# EAGLE schematic lt3652-pre-v05 (EAGLE 5.10)
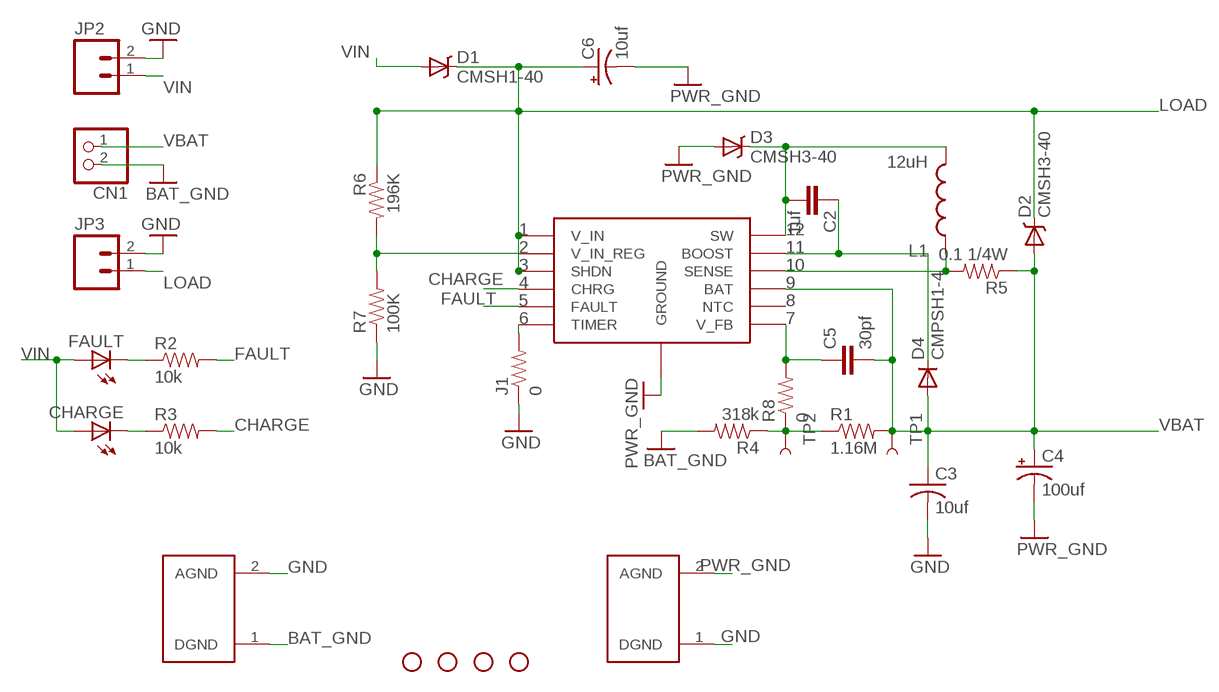
[diagram p0: schematic, sheet 1]

## Parts
C2  1uf  CAP0805  [0805]
C3  10uf  C-USC1210  [C1210]
C4  100uf  CAP_POL7343  [EIA7343]
C5  30pf  CAP0805  [0805]
C6  10uf  CAP_POLE  [PANASONIC_E]
CHARGE  LED0603  [LED-0603]
CN1  JST_2PIN-SMT-RA  [JST-PH-2-SMT-RA]
D1  CMSH1-40  CMSH3-40  [CMSH3-40]
D2  CMSH3-40  [CMSH3-40]
D3  CMSH3-40  [CMSH3-40]
D4  CMPSH1-4  DIODESMA  [SMA-DIODE]
FAULT  LED0603  [LED-0603]
J1  0  RESISTOR  [0805]
JP1  STAND-OFF  [STAND-OFF]
JP2  M023.5MM  [SCREWTERMINAL-3.5MM-2]
JP3  M023.5MM  [SCREWTERMINAL-3.5MM-2]
JP4  STAND-OFF  [STAND-OFF]
JP5  STAND-OFF  [STAND-OFF]
JP6  STAND-OFF  [STAND-OFF]
L1  12uH  PANASONIC_ELLCTV  [PANASONIC_ELLCTV]
R1  1.16M  RESISTOR0603-RES  [0603-RES]
R2  10k  RESISTOR0603-RES  [0603-RES]
R3  10k  RESISTOR0603-RES  [0603-RES]
R4  318k  RESISTOR0603-RES  [0603-RES]
R5  0.1 1/4W  RESISTOR1206  [1206]
R6  196K  RESISTOR0603-RES  [0603-RES]
R7  100K  RESISTOR0603-RES  [0603-RES]
R8  0  RESISTOR0603-RES  [0603-RES]
TP1  TEST-POINT3X5  [PAD.03X.05]
TP2  TEST-POINT3X5  [PAD.03X.05]
U$1  LTC3652_MSOP  [MSOP12]
U$2  AGND_GND  [GND_CONNECT]
U$3  AGND_GND  [GND_CONNECT]

## Nets
BAT_GND: CN1.2 R4.2 U$2.1(DGND)
CHARGE: R3.2 U$1.4(CHRG)
FAULT: R2.2 U$1.5(FAULT)
GND: J1.1 JP2.2 JP3.2 R7.1 U$2.2(AGND) U$3.1(DGND)
LOAD: C6.+ D1.2(C) D2.2(C) JP3.1 R6.1 U$1.1(V_IN) U$1.3(SHDN)
N$1: C5.1 R8.2 U$1.7(V_FB)
N$2: R1.1 R4.1 R8.1 TP2.P$1
N$3: C2.1 D4.C U$1.11(BOOST)
N$4: CHARGE.C R3.1
N$5: FAULT.C R2.1
N$6: L1.1 R5.2 U$1.10(SENSE)
N$13: C2.2 D3.2(C) L1.2 U$1.12(SW)
N$17: J1.2 U$1.6(TIMER)
N$18: R6.2 R7.2 U$1.2(V_IN_REG)
PWR_GND: C3.2 C4.C(-) C6.- D3.1(A) U$1.GND(GROUND) U$3.2(AGND) ; supply symbol labelled GND
VBAT: C3.1 C4.A(+) C5.2 CN1.1 D2.1(A) D4.A R1.2 R5.1 TP1.P$1 U$1.9(BAT)
VIN: CHARGE.A D1.1(A) FAULT.A JP2.1
Unconnected: U$1.8(NTC)

## Library data of the parts
C2 C5 = SparkFun:CAP: Capacitor Standard 0603 ceramic capacitor, and 0.1" leaded capacitor.
C3 = adafruit:C-US: CAPACITOR, American symbol
C4 C6 = SparkFun:CAP_POL: Capacitor Polarized These are standard SMD and PTH capacitors. Normally 10uF, 47uF, and 100uF in electrolytic and tantalum varieties. Always verify the external diameter of the through hole cap, it varies with capacity, voltage, and manufacturer. The EIA devices should be standard.
CHARGE FAULT = SparkFun:LED: LEDs Standard schematic elements and footprints for 5mm, 3mm, 1206, and 0603 sized LEDs. 5mm - Spark Fun Electronics SKU : COM-00529 (and others)
CN1 = adafruit:JST_2PIN: JST 2-Pin Connectors of various flavors SMT-RA (S2B-PH-SM4) 4UConnector #17311 SMT (B2B-PH-SM4) THM-RA (S2B-PH) THM (B2B-PH)
D1-D3 = ssozonoff:CMSH3-40
D4 = SparkFun:DIODE: Diode These are standard reverse protection diodes and small signal diodes. SMA package can handle up to about 1A. SOD-323 can handle about 200mA. What the SOD-323 package when ordering, there are some mfgs out there that are 5-pin packages.
J1 R1-R8 = SparkFun:RESISTOR: Resistor Basic schematic elements and footprints for 0603, 1206, and PTH 1/10th watt (small) resistors.
JP1 JP4-JP6 = SparkFun:STAND-OFF: Stand Off This is the mechanical footprint for a #4 phillips button head screw. Use the keepout ring to avoid running the screw head into surrounding components. SKU : PRT-00447
JP2 JP3 = SparkFun:M02: Header 2 Standard 2-pin 0.1" header. Use with straight break away headers (SKU : PRT-00116), right angle break away headers (PRT-00553), swiss pins (PRT-00743), machine pins (PRT-00117), and female headers (PRT-00115). Molex polarized connector foot print use with SKU : PRT-08233 with associated crimp pins and housings.
L1 = ssozonoff:PANASONIC_ELLCTV
TP1 TP2 = SparkFun:TEST-POINT
U$1 = ssozonoff:LTC3652_MSOP
U$2 U$3 = ssozonoff:AGND_GND